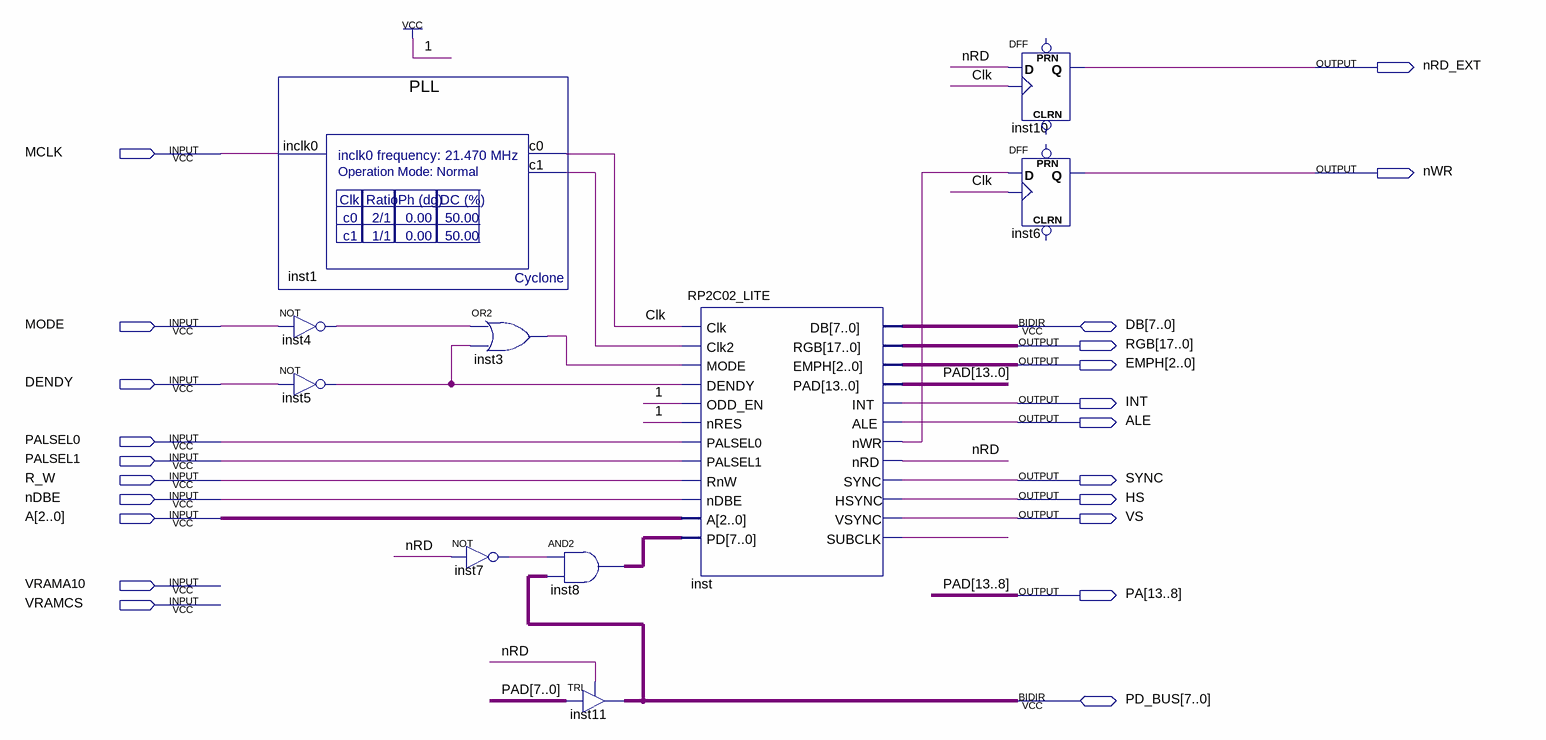
[diagram p0: schematic sheet]
// Quartus schematic PPU_LITE.bdf as structural Verilog: 10 symbols, 22 pins
module PPU_LITE (
  input  MCLK,
  input  MODE,
  input  DENDY,
  input  PALSEL0,
  input  PALSEL1,
  input  R_W,
  input  nDBE,
  input  [2:0] A,
  input  VRAMA10,
  input  VRAMCS,
  inout  [7:0] DB,
  inout  [7:0] PD_BUS,
  output nRD_EXT,
  output nWR,
  output [17:0] RGB,
  output [2:0] EMPH,
  output INT,
  output ALE,
  output SYNC,
  output HS,
  output VS,
  output [13:8] PA
);

  wire Clk, inst1_c1, inst3_out, inst4_out, inst5_out, inst7_out, inst_nwr, inst_subclk, nRD;
  wire [7:0] inst8_out, PAD;

  PLL inst1 (.inclk0(MCLK), .c0(Clk), .c1(inst1_c1));
  not inst4 (inst4_out, MODE);
  not inst5 (inst5_out, DENDY);
  or inst3 (inst3_out, inst4_out, inst5_out);
  not inst7 (inst7_out, nRD);
  assign inst8_out = {8{inst7_out}} & PD_BUS;  // AND2 inst8, 8 bits wide
  TRI inst11[7:0] (.IN(PAD), .OE(nRD), .OUT(PD_BUS));
  RP2C02_LITE inst (
    .Clk(Clk), .Clk2(inst1_c1), .MODE(inst3_out), .DENDY(inst5_out), .ODD_EN(1'b1), .nRES(1'b1),
    .PALSEL0(PALSEL0), .PALSEL1(PALSEL1), .RnW(R_W), .nDBE(nDBE), .A(A), .PD(inst8_out), .RGB(RGB),
    .EMPH(EMPH), .PAD({PA, PAD}), .INT(INT), .ALE(ALE), .nWR(inst_nwr), .nRD(nRD), .SYNC(SYNC), .HSYNC(HS),
    .VSYNC(VS), .SUBCLK(inst_subclk), .DB(DB));
  DFF inst10 (.CLK(Clk), .D(nRD), .Q(nRD_EXT));  // open: CLRN, PRN
  DFF inst6 (.CLK(Clk), .D(inst_nwr), .Q(nWR));  // open: CLRN, PRN

  // Other names for the same wires on the sheet: PAD[13:8] = PA
endmodule
